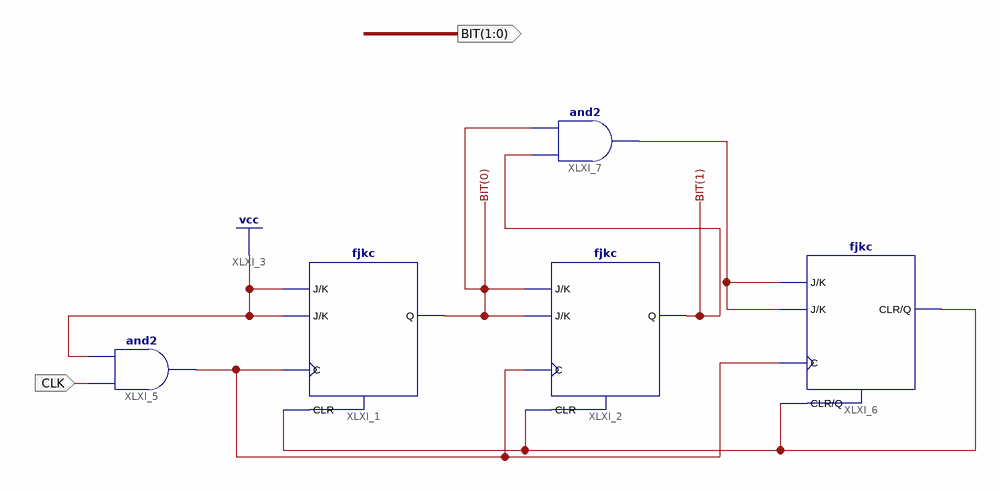
[diagram p0: schematic sheet 1]
// Xilinx ISE schematic Counter03.sch (spartan6) as structural Verilog: 5 symbols, 2 ports
module Counter03 (
  input  CLK,
  output [1:0] BIT
);

  wire XLXN_1, XLXN_8, XLXN_10;

  fjkc XLXI_1 (.C(XLXN_1), .CLR(XLXN_8), .J(1'b1), .K(1'b1), .Q(BIT[0]));
  fjkc XLXI_2 (.C(XLXN_1), .CLR(XLXN_8), .J(BIT[0]), .K(BIT[0]), .Q(BIT[1]));
  and XLXI_5 (XLXN_1, CLK, 1'b1);
  fjkc XLXI_6 (.C(XLXN_1), .CLR(XLXN_8), .J(XLXN_10), .K(XLXN_10), .Q(XLXN_8));
  and XLXI_7 (XLXN_10, BIT[1], BIT[0]);
endmodule
